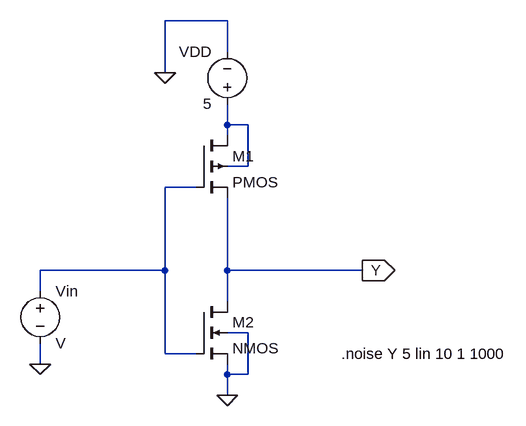
[diagram p0: schematic CMOS.asc]
CMOS.asc, the LTspice schematic file:
Version 4
SHEET 1 1192 992
WIRE 720 336 624 336
WIRE 720 384 720 336
WIRE 624 416 624 336
WIRE 720 496 720 464
WIRE 752 496 720 496
WIRE 720 512 720 496
WIRE 752 560 752 496
WIRE 752 560 720 560
WIRE 672 592 624 592
WIRE 624 720 624 592
WIRE 624 720 432 720
WIRE 720 720 720 608
WIRE 928 720 720 720
WIRE 432 752 432 720
WIRE 720 768 720 720
WIRE 752 816 720 816
WIRE 624 848 624 720
WIRE 672 848 624 848
WIRE 432 864 432 832
WIRE 720 880 720 864
WIRE 752 880 752 816
WIRE 752 880 720 880
WIRE 720 912 720 880
FLAG 720 912 0
FLAG 624 416 0
FLAG 928 720 Y
IOPIN 928 720 Out
FLAG 432 864 0
SYMBOL pmos4 672 512 R0
SYMATTR InstName M1
SYMATTR Value2 l=180nm w=360um
SYMBOL nmos4 672 768 R0
SYMATTR InstName M2
SYMATTR Value2 l=180nm w=360um
SYMBOL voltage 720 480 R180
WINDOW 0 24 96 Left 2
WINDOW 3 24 16 Left 2
WINDOW 123 0 0 Left 0
WINDOW 39 0 0 Left 0
SYMATTR InstName VDD
SYMATTR Value 5
SYMBOL voltage 432 736 R0
SYMATTR InstName Vin
TEXT 896 848 Left 2 !.noise Y 5 lin 10 1 1000

The netlist it stands for:
* CMOS.asc
M1 N001 N002 Y N001 PMOS l=180nm w=360um
M2 Y N002 0 0 NMOS l=180nm w=360um
VDD N001 0 5
Vin N002 0 V
.model NMOS NMOS
.model PMOS PMOS
.lib standard.mos
.noise Y 5 lin 10 1 1000
.backanno
.end